# Altium project POWER_BOARD_FINAL.PrjPcb
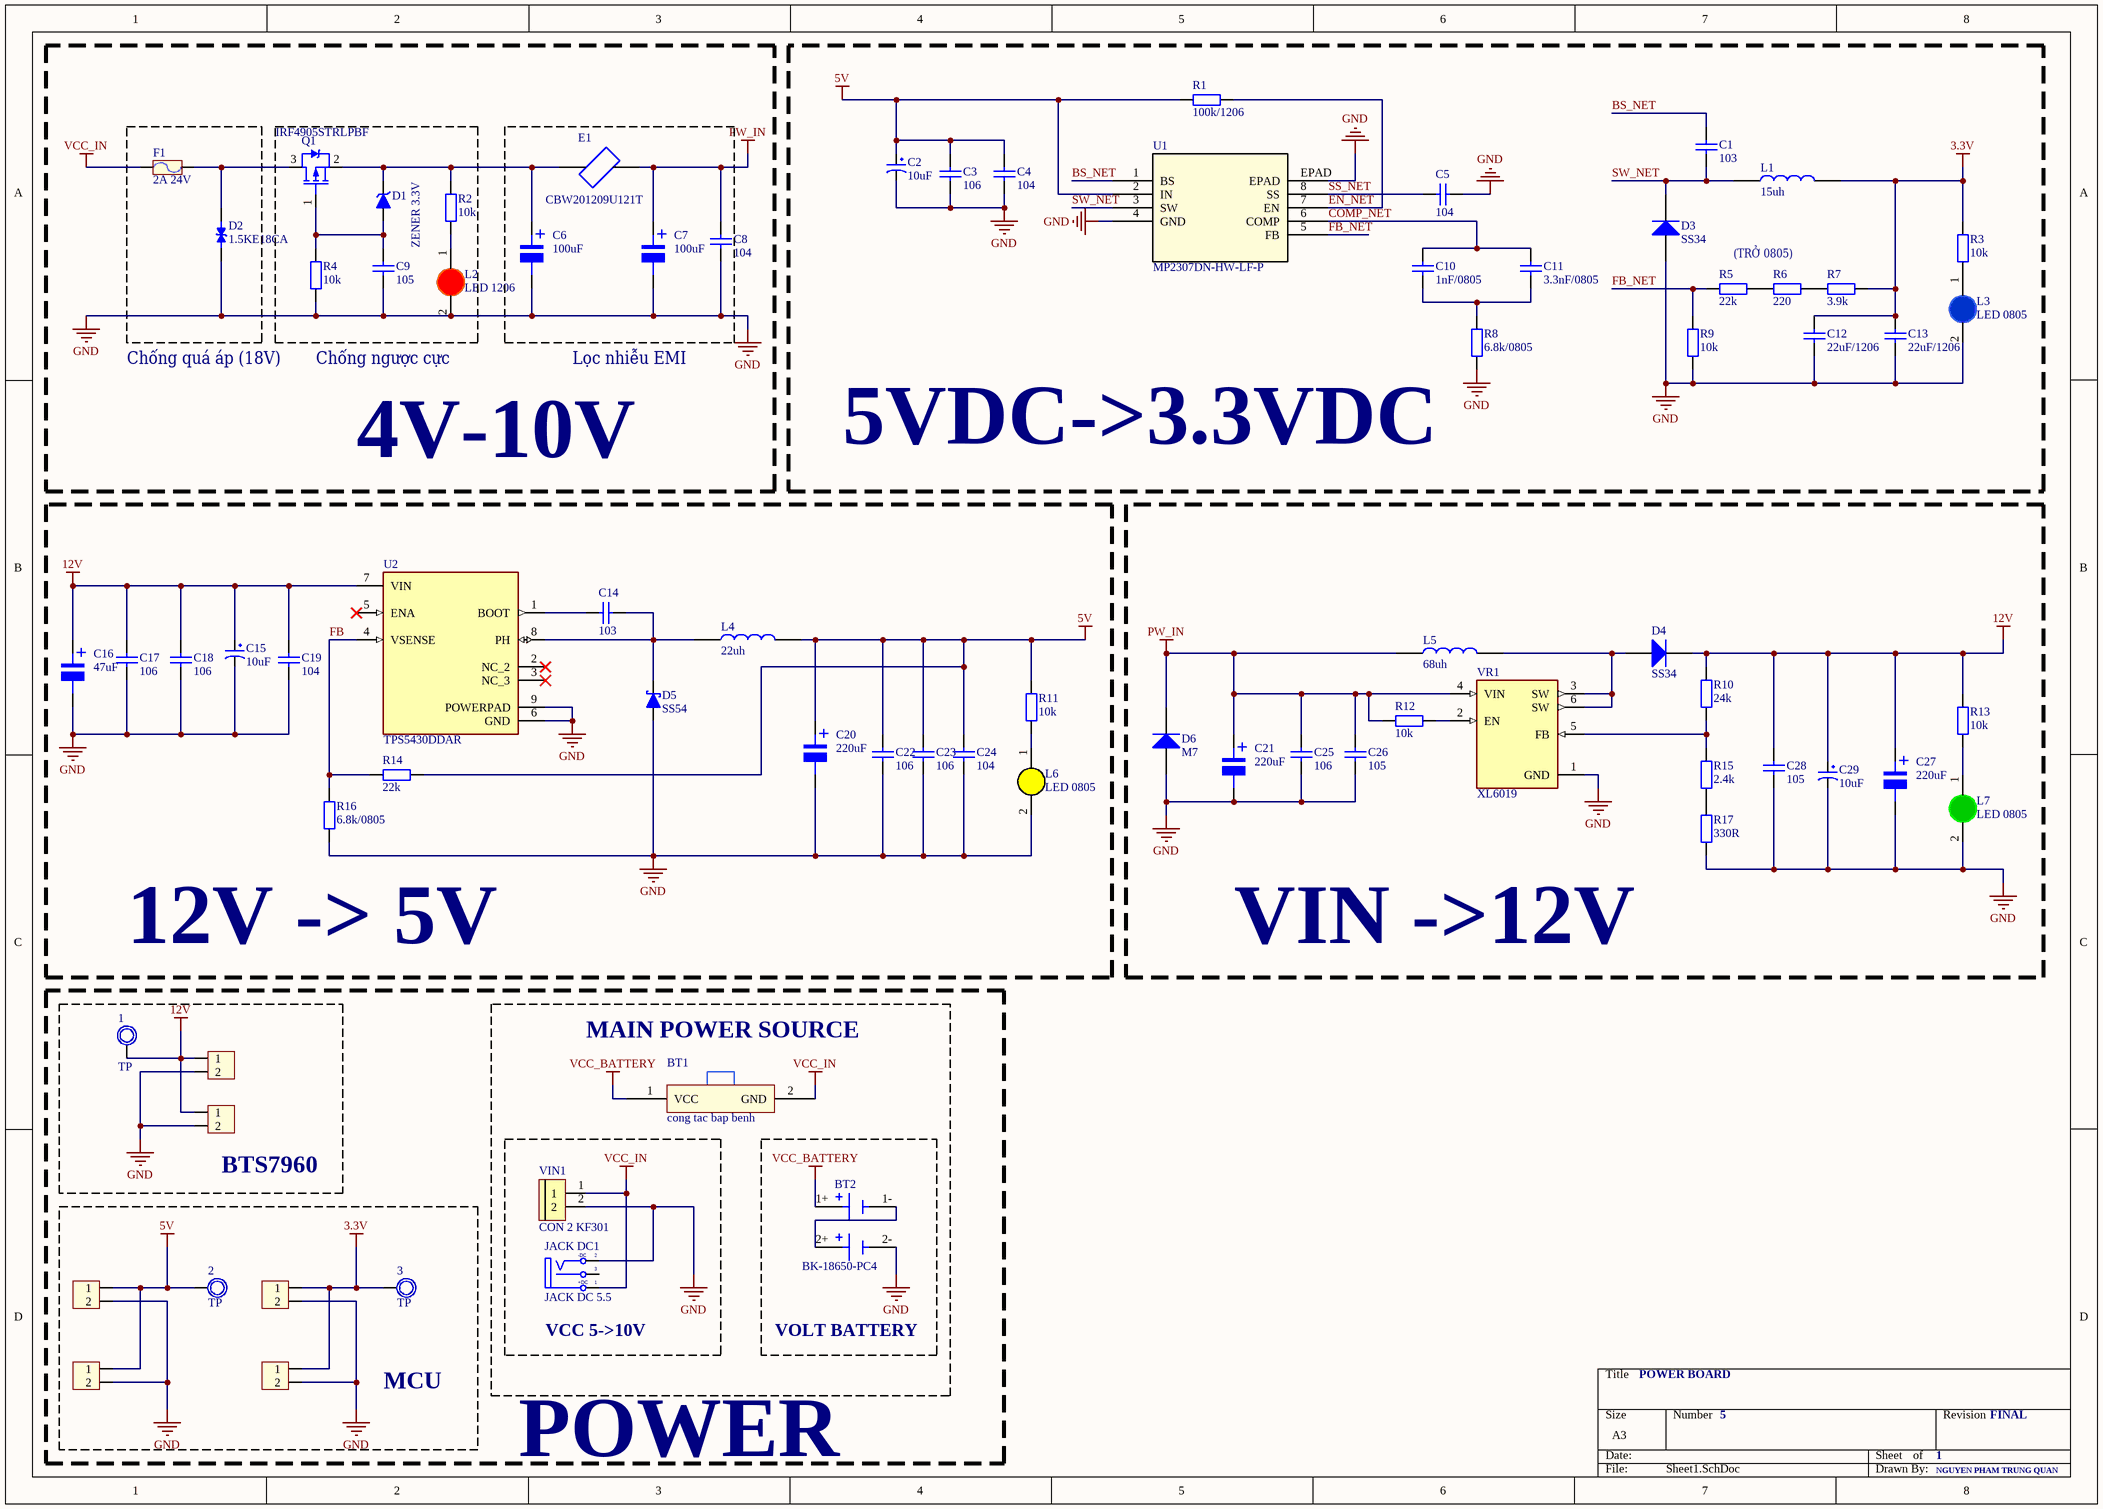
[diagram p0: Sheet1.SchDoc]
1 sheet, 78 parts. Net scope: global (net labels, ports and power ports of the same name join across sheets).
Board file: POWER_BOARD.PcbDoc

## Sheet Sheet1.SchDoc
size A3; SheetNumber: 1; SheetTotal: 1

### Parts
1  TP  [TP1]
2  TP  [TP1]
3  TP  [TP1]
BT1  cong tac bap benh  [CONG TAC BAP BENH]
BT2  BK-18650-PC4  [BAT_BK-18650-PC4]
C1  103  [tu 1206]
C2  10uF  [tu tantalum smd3216]
C3  106  [tu 0805]
C4  104  [tu 0805]
C5  104  [tu 0805]
C6  100uF  [tu nhom 8 (f)]
C7  100uF  [tu nhom 8 (f)]
C8  104  [tu 0805]
C9  105  [tu 0805]
C10  1nF/0805  [tu 0805]
C11  3.3nF/0805  [tu 0805]
C12  22uF/1206  [tu 1206]
C13  22uF/1206  [tu 1206]
C14  103  [tu 1206]
C15  10uF  [tu tantalum smd3216]
C16  47uF  [tu nhom 6.3 (D)]
C17  106  [tu 0805]
C18  106  [tu 0805]
C19  104  [tu 0805]
C20  220uF  [tu nhom 6.3 (d)]
C21  220uF  [tu nhom 8 (e)]
C22  106  [tu 0805]
C23  106  [tu 0805]
C24  104  [tu 0805]
C25  106  [tu 0805]
C26  105  [tu 0805]
C27  220uF  [tu nhom 8 (e)]
C28  105  [tu 0805]
C29  10uF  [tu tantalum smd3216]
D1  ZENER 3.3V  [SOD123]
D2  1.5KE18CA  [DIOAD1586W101L900D530]
D3  SS34  [DIODE SMA]
D4  SS34  [DIODE SMA]
D5  SS54  [DO-214AC (SMA)]
D6  M7  [DIODE SMA]
E1  CBW201209U121T  [FB_LI0805H121R-10]
F1  2A 24V  [Cau chi tu phuc hoi 2A 24V SMD1812]
H1  Header 2P 2.54 Duc Cong  [Header 2P DC 2.54]  (value not drawn)
H2  Header 2P 2.54 Duc Cong  [Header 2P DC 2.54]  (value not drawn)
H3  Header 2P 2.54 Duc Cong  [Header 2P DC 2.54]  (value not drawn)
H4  Header 2P 2.54 Duc Cong  [Header 2P DC 2.54]  (value not drawn)
H5  Header 2P 2.54 Duc Cong  [Header 2P DC 2.54]  (value not drawn)
H6  Header 2P 2.54 Duc Cong  [Header 2P DC 2.54]  (value not drawn)
JACK_DC1  JACK DC 5.5  [JACK DC 5.5]
L1  15uh  [Cuon Cam 12x12x10]
L2  LED 1206  [LED-1206-Red]
L3  LED 0805  [LED-1206-Blue]
L4  22uh  [Cuon Cam 12x12x10]
L5  68uh  [Cuon Cam 12x12x10]
L6  LED 0805  [LED-1206-Yellow]
L7  LED 0805  [LED-1206-Green]
Q1  IRF4905STRLPBF  [TO-263 (D2PAK)]
R1  100k/1206  [tro smd 1206]
R2  10k  [tro smd 0805]
R3  10k  [tro smd 0805]
R4  10k  [tro smd 0805]
R5  22k  [tro smd 0805]
R6  220  [tro smd 0805]
R7  3.9k  [Tro SMD 0805]
R8  6.8k/0805  [tro smd 0805]
R9  10k  [tro smd 0805]
R10  24k  [tro smd 0805]
R11  10k  [tro smd 0805]
R12  10k  [tro smd 0805]
R13  10k  [tro smd 0805]
R14  22k  [tro smd 0805]
R15  2.4k  [Tro SMD 0805]
R16  6.8k/0805  [tro smd 0805]
R17  330R  [Tro SMD 0805]
U1  MP2307DN-HW-LF-P  [IC8_MP2307_MNP]
U2  TPS5430DDAR  [CONV_TPS5430DDAR]
VIN1  CON 2 KF301  [Con 2 KF301 5.08]
VR1  XL6019  [DPAK170P1435X465-6N]

### Blocks framed on the sheet
4V-10V: C6-C9 D1 D2 E1 F1 L2 Q1 R2 R4
5VDC->3.3VDC: C1-C5 C10-C13 D3 L1 L3 R1 R3 R5-R9 U1
12V -> 5V: C14-C20 C22-C24 D5 L4 L6 R11 R14 R16 U2
VIN ->12V: C21 C25-C29 D4 D6 L5 L7 R10 R12 R13 R15 R17 VR1
BTS7960: 1 H1 H2
MAIN POWER SOURCE: BT1
VCC 5->10V: JACK_DC1 VIN1
VOLT BATTERY: BT2
MCU: 2 3 H3-H6

### Nets
3.3V: 3.1 C12.1 C13.1 H4.1 H6.1 L1.2 R3.2 R7.2
5V: 2.1 C2.1 C3.1 C4.1 C20.1 C22.1 C23.1 C24.1 H3.1 H5.1 L4.2 R1.2 R11.1 R14.2 U1.2(IN)
12V: 1.1 C15.1 C16.1 C17.1 C18.1 C19.1 C27.1 C28.1 C29.1 D4.2(K) H1.1 H2.1 R10.2 R13.1 U2.7(VIN)
GND: BT2.2- C2.2 C3.2 C4.2 C5.2 C6.2 C7.2 C8.2 C9.2 C12.2 C13.2 C15.2 C16.2 C17.2 C18.2 C19.2 C20.2 C21.2 C22.2 C23.2 C24.2 C25.2 C26.2 C27.2 C28.2 C29.2 D2.1 D3.1(A) D5.1(A) D6.1(A) H1.2 H2.2 H3.2 H4.2 H5.2 H6.2 JACK_DC1.2(TN) L2.2(K) L3.2(K) L6.2(K) L7.2(K) R4.1 R8.2 R9.1 R16.2 R17.2 U1.4(GND) U1.EPAD U2.6(GND) U2.9(POWERPAD) VIN1.2 VR1.1(GND)
PW_IN: C7.1 C8.1 C21.1 C25.1 C26.1 D6.2(K) E1.2 L5.1 R12.2 VR1.4(VIN)
VCC_BATTERY: BT1.1(VCC) BT2.1+
VCC_IN: BT1.2(GND) F1.1 JACK_DC1.1(T) VIN1.1
BS_NET: C1.1 U1.1(BS)
COMP_NET: C10.1 C11.1 U1.6(COMP)
EN_NET: R1.1 U1.7(EN)
FB: R14.1 R16.1 U2.4(VSENSE)
FB_NET: R5.1 R9.2 U1.5(FB)
SS_NET: C5.1 U1.8(SS)
SW_NET: C1.2 D3.2(K) L1.1 U1.3(SW)
NetBT2_1-: BT2.1- BT2.2+
NetC6_1: C6.1 D1.2(K) E1.1 Q1.2(S) R2.2
NetC9_1: C9.1 D1.1(A) Q1.1(G) R4.2
NetC10_2: C10.2 C11.2 R8.1
NetC14_1: C14.1 U2.1(BOOT)
NetC14_2: C14.2 D5.2(K) L4.1 U2.8(PH)
NetD2_2: D2.2 F1.2 Q1.3(D)
NetD4_1: D4.1(A) L5.2 VR1.3(SW) VR1.6(SW)
NetL2_1: L2.1(A) R2.1
NetL3_1: L3.1(A) R3.1
NetL6_1: L6.1(A) R11.2
NetL7_1: L7.1(A) R13.2
NetR5_2: R5.2 R6.1
NetR6_2: R6.2 R7.1
NetR10_1: R10.1 R15.2 VR1.5(FB)
NetR12_1: R12.1 VR1.2(EN)
NetR15_1: R15.1 R17.1

Not connected (* = marked no-connect by the designer): JACK_DC1 3(S); U2 2(NC_2)* 3(NC_3)* 5(ENA)*

### Notes on the sheet
- (TRỞ 0805)
- Chống quá áp (18V)
- Chống ngược cực
- Lọc nhiễu EMI
- POWER BOARD
- 5
- 1
- FINAL
- POWER
- NGUYEN PHAM TRUNG QUAN
- (in symbol JACK DC 5.5) -DC; +DC
- (in symbol Tu Nhom 47uF 16V) +
- (in symbol Tu Nhom 100uF 50V) +
- (in symbol Tu Nhom 220uF 10V) +
- (in symbol Tu Nhom 220uF 16V) +

### Library data of the parts
1-3 = TP1: Test Point; Value: Test Point
BT2 = BK-18650-PC4: Battery Holder (Open) 18650 2 Cell PC Pin; Price: None; Value: *; Package: None; Availability: Unavailable; MP: BK-18650-PC4
C1 C14 = Tu 1206 103 50V 10%: Dán; Don_Vi: Con; So_Chan: 2; Ten_Linh_Kien: Tụ 1206 103-10nF 10% 50V; Ma_Hang: MH004543; Chung_Loai: Dán; Kieu_Chan: *
C2 C15 C29 = Tu tantalum 10uF 16V SMD3216: Dán; Don_Vi: Con; So_Chan: 2; Ten_Linh_Kien: Tụ tantalum 106C-10uF 16V SMD3216; Ma_Hang: MH001954; Chung_Loai: Dán; Kieu_Chan: *
C3 C17 C18 C22 C23 C25 = Tu 0805 106 16V 10%: Dán; Ten_Linh_Kien: Tụ 0805 106-10uF 10% 16V; So_Chan: 2; Don_Vi: Con; Ma_Hang: MH004553; Chung_Loai: Dán; Kieu_Chan: *
C4 C5 C8 C19 C24 = Tu 0805 104 50V 10%: Dán; Don_Vi: Con; So_Chan: 2; Ten_Linh_Kien: Tụ 0805 104-100nF 10% 50V; Ma_Hang: MH004551; Chung_Loai: Dán; Kieu_Chan: *
C6 C7 = Tu Nhom 100uF 50V: Dán; Don_Vi: Con; So_Chan: 2; Ten_Linh_Kien: Tụ Nhôm 100uF 50V 8x10.2MM; Ma_Hang: MH002223; Chung_Loai: Dán; Kieu_Chan: *
C9 C26 C28 = Tu 0805 105 50V 10%: Dán; Don_Vi: Con; So_Chan: 2; Ten_Linh_Kien: Tụ 0805 105-1uF 10% 50V; Ma_Hang: MH004552; Chung_Loai: Dán; Kieu_Chan: *
C10 = Tu 0805 102 50V 10%: Dán; Don_Vi: Con; So_Chan: 2; Ten_Linh_Kien: Tụ 0805 102-1nF 10% 50V; Ma_Hang: MH004549; Chung_Loai: Dán; Kieu_Chan: *
C11 = Tu 0805 332 50V 10%: Dán; Don_Vi: Con; So_Chan: 2; Ten_Linh_Kien: Tụ 0805 332-3.3nF 10% 50V; Ma_Hang: MH004561; Chung_Loai: Dán; Kieu_Chan: *
C12 C13 = Tu 1206 226 16V 20%: Dán; Don_Vi: Con; So_Chan: 2; Ten_Linh_Kien: Tụ 1206 226-22uF 20% 16V; Ma_Hang: MH004546; Chung_Loai: Dán; Kieu_Chan: *
C16 = Tu Nhom 47uF 16V: Dán; Don_Vi: Con; So_Chan: 2; Ten_Linh_Kien: Tụ Nhôm 47uF 16V; Ma_Hang: MH007468; Chung_Loai: Dán; Kieu_Chan: *
C20 = Tu Nhom 220uF 16V: Dán; Don_Vi: Con; So_Chan: 2; Ten_Linh_Kien: Tụ Nhôm 220uF 16V 6.3x7.7MM; Ma_Hang: MH002227; Chung_Loai: Dán; Kieu_Chan: *
C21 C27 = Tu Nhom 220uF 10V: Dán; So_Chan: 2; Ten_Linh_Kien: Tụ Nhôm 220uF 10V; Ma_Hang: MH004021; Don_Vi: Con; Chung_Loai: Dán; Kieu_Chan: *
D1 = Diode Zener: Zener Diode
D2 = 1.5KE18CA: 32.5V Clamp 308A (8/20Âµs) Ipp Tvs Diode Through Hole DO-201; MF: STMicroelectronics; SnapEDA_Link: https://www.snapeda.com/parts/1.5KE18CA/STMicroelectronics/view-part/?ref=snap; Package: DO-201 Littelfuse; Value: *; MP: 1.5KE18CA; Check_prices: https://www.snapeda.com/parts/1.5KE18CA/STMicroelectronics/view-part/?ref=eda
D3 D4 = Diode SS34 ( 1N5822 ): Dán; Don_Vi: Con; Ma_Hang: MH002104; Ten_Linh_Kien: Diode SS34 3A 40V SMA ( 1N5822 SS34A); Kieu_Chan: *; Chung_Loai: Dán
D5 = Diode Schottky: Schottky Diode
D6 = Diode M7 ( 4007 ): Dán; Don_Vi: Con; Ten_Linh_Kien: Diode M7 1N4007 SMD 1A 1000V; Ma_Hang: MH000944; Chung_Loai: Dán; Ghi_Chu: *
E1 = LI0805H121R-10: EMI Ferrite Chip Bead, 0805, 800MA, 120Ohms @100MHz, DCR Max 0.150Ohm | Laird Performance Materials LI0805H121R-10; SnapEDA_Link: https://www.snapeda.com/parts/LI0805H121R-10/Laird/view-part/?ref=snap; Package: 0805 Laird; Value: *; MF: Laird; MP: LI0805H121R-10; Check_prices: https://www.snapeda.com/parts/LI0805H121R-10/Laird/view-part/?ref=eda
F1 = Cau chi tu phuc hoi 2A 24V SMD1812: 2A 24V SMD1812; Ma_Hang: MH010033; Ten: Cầu Chì Tự Phục Hồi 2A 24V SMD1812
H1-H6 = Header 2P 2.54 Duc Cong: Cắm; Ten_Linh_Kien: Header 2P XH2.54-2P Đực Cong; Don_Vi: Con; Ma_Hang: MH002852; Chung_Loai: Cắm
JACK_DC1 = JACK DC 5.5: Value: Jac DC
L1 L4 L5 = CUON CAM 100uH SMD: Dán; Don_Vi: Con; Ma_Hang: MH003999; Ten_Linh_Kien: Cuộn Cảm 100uH 7x7x4MM CD74; Ma_Hang: *; Kieu_Chan: *; Chung_Loai: Dán
L2 = LED 1206 Do: Dán; Don_Vi: Con; Ma_Hang: MH002334; Ten_Linh_Kien: LED1206 Màu Đỏ (Red); Ghi_Chu: *; Kieu_Chan: *; Chung_Loai: Dán
L3 = LED 1206 Xanh Duong: Dán; Don_Vi: Con; Ma_Hang: MH002333; Ten_Linh_Kien: LED1206 Màu Xanh Dương (Blue); Ghi_Chu: *; Kieu_Chan: *; Chung_Loai: Dán
L6 = LED 1206 Vang: Dán; Don_Vi: Con; Ma_Hang: MH002331; Ten_Linh_Kien: LED1206 Màu Vàng (Yellow); Ghi_Chu: *; Kieu_Chan: *; Chung_Loai: Dán
L7 = LED 1206 Xanh La: Dán; Don_Vi: Con; Ma_Hang: MH002947; Ten_Linh_Kien: LED1206 Màu Xanh Lá (Green); Ghi_Chu: *; Kieu_Chan: *; Chung_Loai: Dán
Q1 = Mosfet P: pin to pad: 2>3 3>2
R1 = Tro 1206 1% 100K: Dán; So_Chan: 2; Don_Vi: Con; Ten_Linh_Kien: Trở 1206 1% 100k; Ma_Hang: MH005890; Chung_Loai: Dán; Kieu_Chan: *
R2-R4 R9 R11-R13 = Tro 0805 5% 10k: Dán; Don_Vi: Con; So_Chan: 2; Ten_Linh_Kien: Trở 0805 5% 10k; Ma_Hang: MH005239; Chung_Loai: Dán; Kieu_Chan: *
R5 R10 R14 = Tro 0805 5% 22k: Dán; Don_Vi: Con; So_Chan: 2; Ten_Linh_Kien: Trở 0805 5% 22k; Ma_Hang: MH005248; Chung_Loai: Dán; Kieu_Chan: *
R6 = Tro 0805 5% 220R: Dán; Don_Vi: Con; So_Chan: 2; Ten_Linh_Kien: Trở 0805 5% 220R; Ma_Hang: MH005259; Chung_Loai: Dán; Kieu_Chan: *
R7 = Tro 0805 5% 3.9k: Dán; Don_Vi: Con; Ma_Hang: MH007670; Ten_Linh_Kien: Trở 0805 5% 3.9k; So_Chan: 2; Chung_Loai: Dán; Kieu_Chan: *
R8 R16 = Tro 0805 5% 6.8k: Dán; Don_Vi: Con; So_Chan: 2; Ten_Linh_Kien: Trở 0805 5% 6.8k; Ma_Hang: MH005311; Chung_Loai: Dán; Kieu_Chan: *
R15 = Tro 0805 5% 2k: Dán; Don_Vi: Con; So_Chan: 2; Ten_Linh_Kien: Trở 0805 5% 2k; Ma_Hang: MH005304; Chung_Loai: Dán; Kieu_Chan: *
R17 = Tro 0805 5% 330R: Dán; Don_Vi: Con; So_Chan: 2; Ten_Linh_Kien: Trở 0805 5% 330R; Ma_Hang: MH005337; Chung_Loai: Dán; Kieu_Chan: *
U1 = MP2307DN-HW-LF-P: 3A 23V 340KHz Synchronous Rectified Step-Down Converter; Manufacturer_Name: Monolithic Power Systems; Copyright: Copyright (C) 2025 Ultra Librarian. All rights reserved.; Manufacturer_Part_Number: MP2307DN-HW-LF-P; Datasheet: https://www.monolithicpower.com/en/documentview/productdocument/index/version/2/document_type/Datasheet/lang/en/sku/MP2307; RefDes: RefDes; Type: Type
U2 = TPS5430DDAR: 5.5V to 36V Input, 3A, 500kHz Step-Down Converter; MF: Texas Instruments; Package: HSOIC-8 Texas Instruments; Check_prices: https://www.snapeda.com/parts/TPS5430DDAR/Texas+Instruments/view-part/?ref=eda; Value: *; Purchase-URL: https://pricing.snapeda.com/search/part/TPS5430DDAR/?ref=eda; Availability: In Stock; SnapEDA_Link: https://www.snapeda.com/parts/TPS5430DDAR/Texas+Instruments/view-part/?ref=snap; MP: TPS5430DDAR; Price: None
VIN1 = CON 2 KF301: Cắm; Ma_Hang: MH000987; Ten_Linh_Kien: CON 2 KF301-2P 5.08MM Xanh Dương; Chung_Loai: Cắm; Ghi_Chu: *; Kieu_Chan: *; Don_Vi: Con
VR1 = XL6009: The XL6009 regulator is a wide input range, current mode, DC/DC converter which is capable of generating either positive or negative output voltages.; MF: XLSEMI; Package: TO-263-5L XLSEMI; Price: None; Value: *; SnapEDA_Link: https://www.snapeda.com/parts/XL6009/XLSEMI/view-part/?ref=snap; MP: XL6009; Availability: Not in stock; Check_prices: https://www.snapeda.com/parts/XL6009/XLSEMI/view-part/?ref=eda